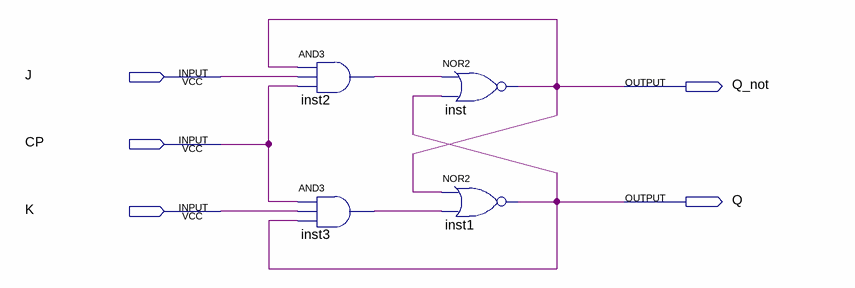
[diagram p0: schematic sheet]
// Quartus schematic JK_FlipFlop.bdf as structural Verilog: 4 symbols, 5 pins
module JK_FlipFlop (
  input  J,
  input  CP,
  input  K,
  output Q_not,
  output Q
);

  wire inst2_out, inst3_out;

  and inst2 (inst2_out, Q_not, J, CP);
  and inst3 (inst3_out, CP, K, Q);
  nor inst (Q_not, inst2_out, Q);
  nor inst1 (Q, Q_not, inst3_out);
endmodule
